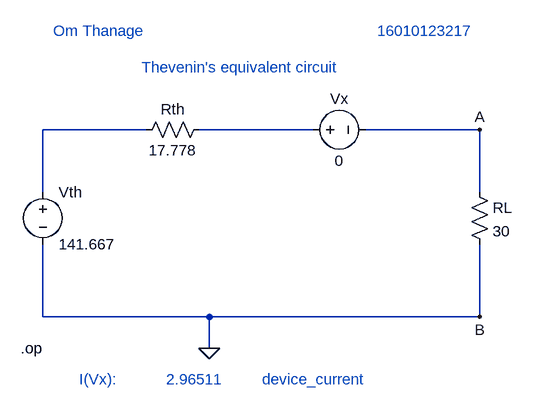
[diagram p0: schematic Draft2.asc]
Draft2.asc, the LTspice schematic file:
Version 4
SHEET 1 880 680
WIRE -688 16 -848 16
WIRE -432 16 -608 16
WIRE -176 16 -352 16
WIRE -848 112 -848 16
WIRE -176 112 -176 16
WIRE -848 304 -848 192
WIRE -592 304 -848 304
WIRE -176 304 -176 192
WIRE -176 304 -592 304
WIRE -592 352 -592 304
FLAG -176 16 A
FLAG -176 304 B
FLAG -592 352 0
SYMBOL voltage -848 96 R0
WINDOW 123 0 0 Left 0
WINDOW 39 0 0 Left 0
SYMATTR InstName Vth
SYMATTR Value 141.667
SYMBOL res -592 0 R90
WINDOW 0 0 56 VBottom 2
WINDOW 3 32 56 VTop 2
SYMATTR InstName Rth
SYMATTR Value 17.778
SYMBOL res -192 96 R0
SYMATTR InstName RL
SYMATTR Value 30
SYMBOL voltage -448 16 R270
WINDOW 0 32 56 VTop 2
WINDOW 3 -32 56 VBottom 2
WINDOW 123 0 0 Left 0
WINDOW 39 0 0 Left 0
SYMATTR InstName Vx
SYMATTR Value 0
TEXT -882 352 Left 2 !.op
TEXT -696 -80 Left 2 ;Thevenin's equivalent circuit
TEXT -792 400 Left 2 ;I(Vx):           2.96511         device_current
TEXT -832 -136 Left 2 ;Om Thanage                                                    16010123217

The netlist it stands for:
* Draft2.asc
Vth N001 0 141.667
Rth N002 N001 17.778
RL A 0 30
Vx N002 A 0
.op
* Thevenin's equivalent circuit
* I(Vx):           2.96511         device_current
* Om Thanage                                                    16010123217
.backanno
.end